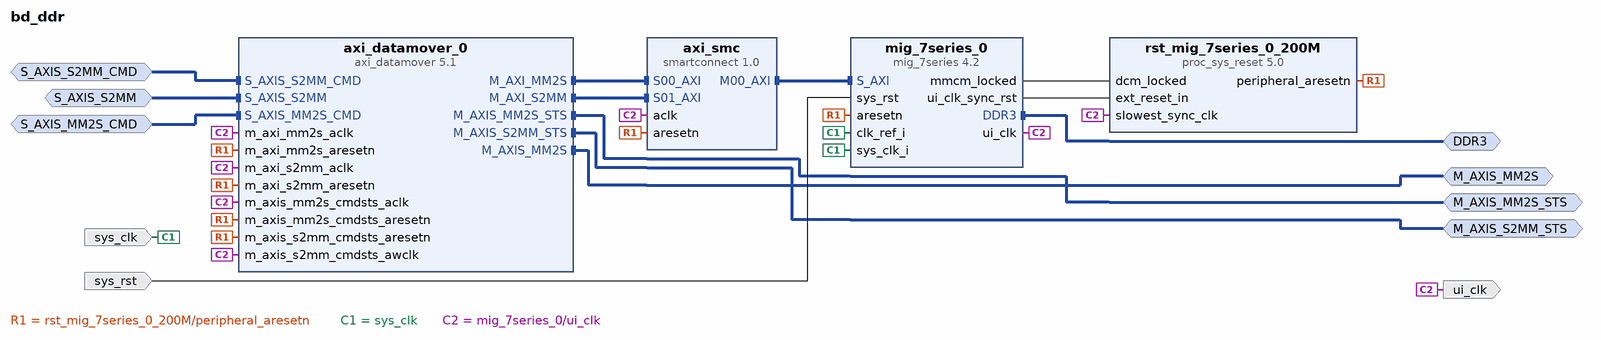
[diagram p0: block diagram of the top level]
# Vivado block design bd_ddr, xc7k160tffg676-2, Vivado 2018.3
create_bd_design bd_ddr

create_bd_intf_port -mode Slave -vlnv xilinx.com:interface:axis_rtl:1.0 S_AXIS_S2MM
set_property -dict [list \
  CONFIG.FREQ_HZ 200000000 \
  CONFIG.HAS_TKEEP 1 \
  CONFIG.HAS_TLAST 1 \
  CONFIG.HAS_TREADY 1 \
  CONFIG.HAS_TSTRB 0 \
  CONFIG.LAYERED_METADATA undef \
  CONFIG.TDATA_NUM_BYTES 8 \
  CONFIG.TDEST_WIDTH 0 \
  CONFIG.TID_WIDTH 0 \
  CONFIG.TUSER_WIDTH 0 \
] [get_bd_intf_ports S_AXIS_S2MM]
create_bd_intf_port -mode Slave -vlnv xilinx.com:interface:axis_rtl:1.0 S_AXIS_S2MM_CMD
set_property -dict [list \
  CONFIG.FREQ_HZ 200000000 \
  CONFIG.HAS_TKEEP 0 \
  CONFIG.HAS_TLAST 0 \
  CONFIG.HAS_TREADY 1 \
  CONFIG.HAS_TSTRB 0 \
  CONFIG.LAYERED_METADATA undef \
  CONFIG.TDATA_NUM_BYTES 9 \
  CONFIG.TDEST_WIDTH 0 \
  CONFIG.TID_WIDTH 0 \
  CONFIG.TUSER_WIDTH 0 \
] [get_bd_intf_ports S_AXIS_S2MM_CMD]
create_bd_intf_port -mode Slave -vlnv xilinx.com:interface:axis_rtl:1.0 S_AXIS_MM2S_CMD
set_property -dict [list \
  CONFIG.FREQ_HZ 200000000 \
  CONFIG.HAS_TKEEP 0 \
  CONFIG.HAS_TLAST 0 \
  CONFIG.HAS_TREADY 1 \
  CONFIG.HAS_TSTRB 0 \
  CONFIG.LAYERED_METADATA undef \
  CONFIG.TDATA_NUM_BYTES 9 \
  CONFIG.TDEST_WIDTH 0 \
  CONFIG.TID_WIDTH 0 \
  CONFIG.TUSER_WIDTH 0 \
] [get_bd_intf_ports S_AXIS_MM2S_CMD]
create_bd_intf_port -mode Master -vlnv xilinx.com:interface:axis_rtl:1.0 M_AXIS_S2MM_STS
set_property -dict {CONFIG.FREQ_HZ 200000000} [get_bd_intf_ports M_AXIS_S2MM_STS]
create_bd_intf_port -mode Master -vlnv xilinx.com:interface:axis_rtl:1.0 M_AXIS_MM2S_STS
set_property -dict {CONFIG.FREQ_HZ 200000000} [get_bd_intf_ports M_AXIS_MM2S_STS]
create_bd_intf_port -mode Master -vlnv xilinx.com:interface:axis_rtl:1.0 M_AXIS_MM2S
set_property -dict {CONFIG.FREQ_HZ 200000000} [get_bd_intf_ports M_AXIS_MM2S]
create_bd_intf_port -mode Master -vlnv xilinx.com:interface:ddrx_rtl:1.0 DDR3
create_bd_port -dir I -type rst sys_rst
set_property -dict {CONFIG.POLARITY ACTIVE_HIGH} [get_bd_ports sys_rst]
create_bd_port -dir I -type clk sys_clk
set_property -dict {CONFIG.ASSOCIATED_RESET sys_rst CONFIG.FREQ_HZ 200000000} [get_bd_ports sys_clk]
create_bd_port -dir O -type clk ui_clk
set_property -dict [list \
  CONFIG.ASSOCIATED_BUSIF S_AXIS_S2MM:S_AXIS_S2MM_CMD:S_AXIS_MM2S_CMD:M_AXIS_S2MM_STS:M_AXIS_MM2S_STS:M_AXIS_MM2S \
  CONFIG.FREQ_HZ 200000000 \
] [get_bd_ports ui_clk]

create_bd_cell -type ip -vlnv xilinx.com:ip:mig_7series:4.2 mig_7series_0
set_property -dict [list \
  CONFIG.BOARD_MIG_PARAM Custom \
  CONFIG.MIG_DONT_TOUCH_PARAM Custom \
  CONFIG.RESET_BOARD_INTERFACE Custom \
  CONFIG.XML_INPUT_FILE mig_b.prj \
] [get_bd_cells mig_7series_0]
create_bd_cell -type ip -vlnv xilinx.com:ip:axi_datamover:5.1 axi_datamover_0
set_property -dict [list \
  CONFIG.c_dummy 0 \
  CONFIG.c_enable_mm2s_adv_sig 0 \
  CONFIG.c_enable_s2mm_adv_sig 0 \
  CONFIG.c_m_axi_mm2s_data_width 128 \
  CONFIG.c_m_axi_s2mm_data_width 128 \
  CONFIG.c_m_axis_mm2s_tdata_width 64 \
  CONFIG.c_mm2s_burst_size 16 \
  CONFIG.c_s2mm_support_indet_btt true \
  CONFIG.c_s_axis_s2mm_tdata_width 64 \
] [get_bd_cells axi_datamover_0]
create_bd_cell -type ip -vlnv xilinx.com:ip:smartconnect:1.0 axi_smc
set_property -dict {CONFIG.NUM_SI 2} [get_bd_cells axi_smc]
create_bd_cell -type ip -vlnv xilinx.com:ip:proc_sys_reset:5.0 rst_mig_7series_0_200M

# ---- connections ----

connect_bd_intf_net [get_bd_intf_pins axi_datamover_0/M_AXI_MM2S] [get_bd_intf_pins axi_smc/S00_AXI]
connect_bd_intf_net [get_bd_intf_pins axi_smc/M00_AXI] [get_bd_intf_pins mig_7series_0/S_AXI]
connect_bd_intf_net [get_bd_intf_ports DDR3] [get_bd_intf_pins mig_7series_0/DDR3]
connect_bd_intf_net [get_bd_intf_pins axi_datamover_0/M_AXI_S2MM] [get_bd_intf_pins axi_smc/S01_AXI]
connect_bd_intf_net -intf_net S_AXIS_S2MM_CMD_0_1 [get_bd_intf_ports S_AXIS_S2MM_CMD] [get_bd_intf_pins axi_datamover_0/S_AXIS_S2MM_CMD]
connect_bd_intf_net [get_bd_intf_ports M_AXIS_MM2S_STS] [get_bd_intf_pins axi_datamover_0/M_AXIS_MM2S_STS]
connect_bd_intf_net [get_bd_intf_ports M_AXIS_S2MM_STS] [get_bd_intf_pins axi_datamover_0/M_AXIS_S2MM_STS]
connect_bd_intf_net -intf_net S_AXIS_S2MM_0_1 [get_bd_intf_ports S_AXIS_S2MM] [get_bd_intf_pins axi_datamover_0/S_AXIS_S2MM]
connect_bd_intf_net [get_bd_intf_ports M_AXIS_MM2S] [get_bd_intf_pins axi_datamover_0/M_AXIS_MM2S]
connect_bd_intf_net -intf_net S_AXIS_MM2S_CMD_0_1 [get_bd_intf_ports S_AXIS_MM2S_CMD] [get_bd_intf_pins axi_datamover_0/S_AXIS_MM2S_CMD]
connect_bd_net [get_bd_pins mig_7series_0/mmcm_locked] [get_bd_pins rst_mig_7series_0_200M/dcm_locked]
connect_bd_net [get_bd_pins mig_7series_0/ui_clk_sync_rst] [get_bd_pins rst_mig_7series_0_200M/ext_reset_in]
connect_bd_net [get_bd_pins rst_mig_7series_0_200M/peripheral_aresetn] \
  [get_bd_pins mig_7series_0/aresetn] [get_bd_pins axi_datamover_0/m_axi_mm2s_aresetn] [get_bd_pins axi_smc/aresetn] \
  [get_bd_pins axi_datamover_0/m_axi_s2mm_aresetn] [get_bd_pins axi_datamover_0/m_axis_mm2s_cmdsts_aresetn] \
  [get_bd_pins axi_datamover_0/m_axis_s2mm_cmdsts_aresetn]
connect_bd_net [get_bd_ports sys_clk] [get_bd_pins mig_7series_0/clk_ref_i] [get_bd_pins mig_7series_0/sys_clk_i]
connect_bd_net [get_bd_pins mig_7series_0/ui_clk] \
  [get_bd_ports ui_clk] [get_bd_pins axi_smc/aclk] [get_bd_pins rst_mig_7series_0_200M/slowest_sync_clk] \
  [get_bd_pins axi_datamover_0/m_axi_mm2s_aclk] [get_bd_pins axi_datamover_0/m_axis_mm2s_cmdsts_aclk] \
  [get_bd_pins axi_datamover_0/m_axi_s2mm_aclk] [get_bd_pins axi_datamover_0/m_axis_s2mm_cmdsts_awclk]
connect_bd_net [get_bd_ports sys_rst] [get_bd_pins mig_7series_0/sys_rst]

# ---- address map ----
assign_bd_address -offset 0x80000000 -range 2G -target_address_space [get_bd_addr_spaces axi_datamover_0/Data_MM2S] [get_bd_addr_segs mig_7series_0/memmap/memaddr]
assign_bd_address -offset 0x80000000 -range 2G -target_address_space [get_bd_addr_spaces axi_datamover_0/Data_S2MM] [get_bd_addr_segs mig_7series_0/memmap/memaddr]

validate_bd_design
save_bd_design
